# EAGLE design Layout_LEDs_Peter (EAGLE 5.07)
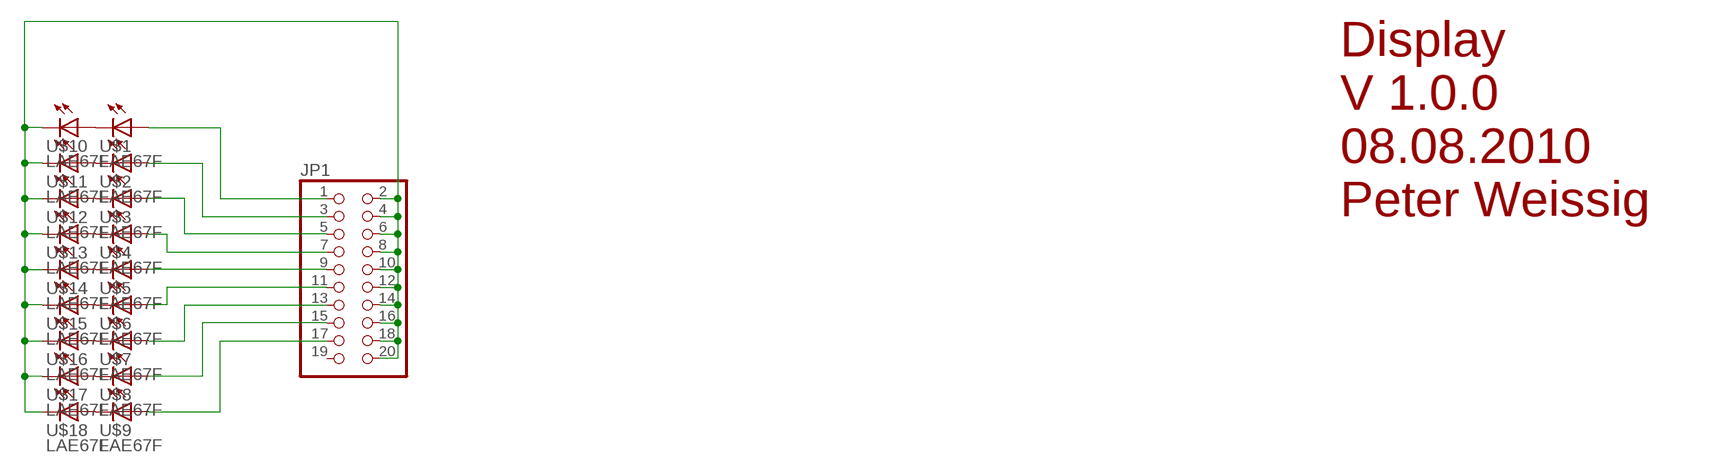
[diagram p0: schematic, sheet 1]

## Parts
JP1  PINHD-2X10  [2X10]
U$1  LAE67F  [P-LCC-4-SCHMALL]
U$2  LAE67F  [P-LCC-4-SCHMALL]
U$3  LAE67F  [P-LCC-4-SCHMALL]
U$4  LAE67F  [P-LCC-4-SCHMALL]
U$5  LAE67F  [P-LCC-4-SCHMALL]
U$6  LAE67F  [P-LCC-4-SCHMALL]
U$7  LAE67F  [P-LCC-4-SCHMALL]
U$8  LAE67F  [P-LCC-4-SCHMALL]
U$9  LAE67F  [P-LCC-4-SCHMALL]
U$10  LAE67F  [P-LCC-4-SCHMALL]
U$11  LAE67F  [P-LCC-4-SCHMALL]
U$12  LAE67F  [P-LCC-4-SCHMALL]
U$13  LAE67F  [P-LCC-4-SCHMALL]
U$14  LAE67F  [P-LCC-4-SCHMALL]
U$15  LAE67F  [P-LCC-4-SCHMALL]
U$16  LAE67F  [P-LCC-4-SCHMALL]
U$17  LAE67F  [P-LCC-4-SCHMALL]
U$18  LAE67F  [P-LCC-4-SCHMALL]

## Nets
GND: JP1.2 JP1.4 JP1.6 JP1.8 JP1.10 JP1.12 JP1.14 JP1.16 JP1.18 JP1.20 U$10.PC$1(C) U$11.PC$1(C) U$12.PC$1(C) U$13.PC$1(C) U$14.PC$1(C) U$15.PC$1(C) U$16.PC$1(C) U$17.PC$1(C) U$18.PC$1(C)
N$1: U$1.PC$1(C) U$10.PA$1(A)
N$2: U$2.PC$1(C) U$11.PA$1(A)
N$3: U$3.PC$1(C) U$12.PA$1(A)
N$4: U$4.PC$1(C) U$13.PA$1(A)
N$5: U$5.PC$1(C) U$14.PA$1(A)
N$6: U$6.PC$1(C) U$15.PA$1(A)
N$7: U$7.PC$1(C) U$16.PA$1(A)
N$8: U$8.PC$1(C) U$17.PA$1(A)
N$9: U$9.PC$1(C) U$18.PA$1(A)
N$10: JP1.9 U$5.PA$1(A)
N$11: JP1.7 U$4.PA$1(A)
N$12: JP1.5 U$3.PA$1(A)
N$13: JP1.3 U$2.PA$1(A)
N$14: JP1.1 U$1.PA$1(A)
N$15: JP1.11 U$6.PA$1(A)
N$16: JP1.13 U$7.PA$1(A)
N$17: JP1.15 U$8.PA$1(A)
N$18: JP1.17 U$9.PA$1(A)
Unconnected: JP1.19

## Notes on the sheet
- Display
- V 1.0.0
- 08.08.2010
- Peter Weissig

## Library data of the parts
JP1 = pinhead:PINHD-2X10: PIN HEADER
U$1-U$18 = led:LAE67F

## Board
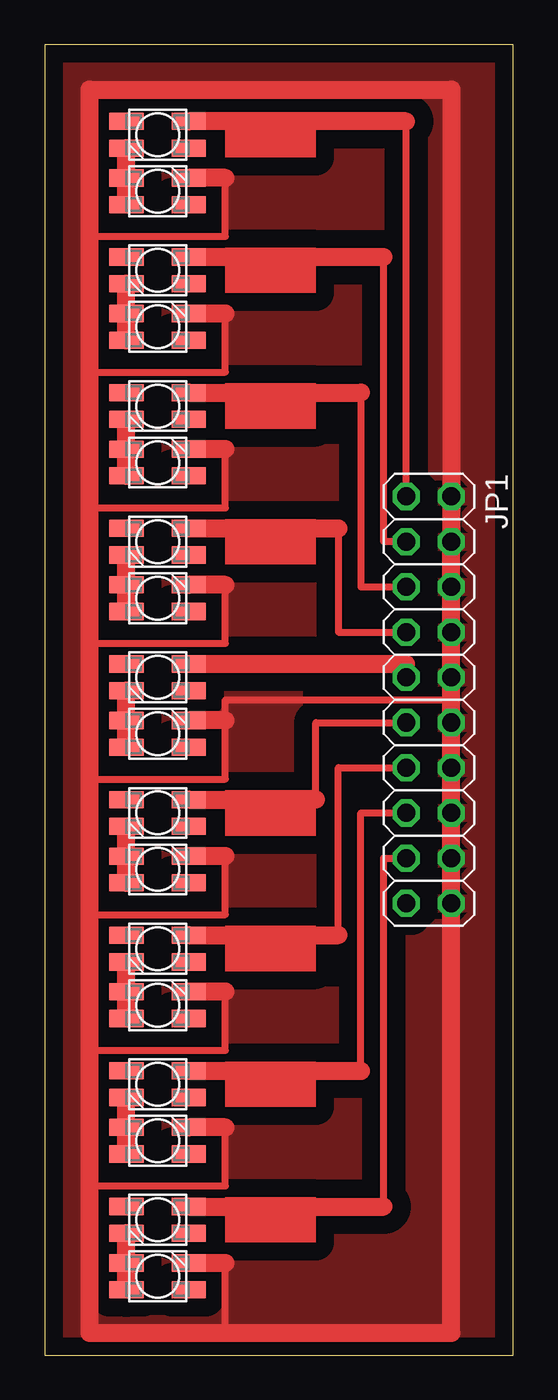
[diagram p1: board, top side]

Size 26.34 x 73.65 mm. Coordinates in mm from the lower left corner, seen from the top.
Outline: 0,0 26.34,0 26.34,73.65 0,73.65 0,0
Copper layers (1*16): Top 0.035mm / dielectric 1.5mm / Bottom 0.035mm
Design rules "default": minimum track width 10mil, minimum drill 24mil, track to track 8mil, track to pad 8mil, pad to pad 8mil, via to via 8mil, smd to smd 8mil, copper to edge 40mil, drill to drill 8mil, minimum pad ring 10mil, minimum via ring 8mil, stop-mask expansion 4mil, vias tented up to drill 0mil, thermal gap 10mil

### Footprints (pad centres in the part's own frame; a part is rotated, then mirrored left to right if it is on the bottom)
2X10 = drill 1.016 octagon: 1 -11.43,-1.27; 2 -11.43,1.27; 3 -8.89,-1.27; 4 -8.89,1.27; 5 -6.35,-1.27; 6 -6.35,1.27; 7 -3.81,-1.27; 8 -3.81,1.27; 9 -1.27,-1.27; 10 -1.27,1.27; 11 1.27,-1.27; 12 1.27,1.27; 13 3.81,-1.27; 14 3.81,1.27; 15 6.35,-1.27; 16 6.35,1.27; 17 8.89,-1.27; 18 8.89,1.27; 19 11.43,-1.27; 20 11.43,1.27
P-LCC-4-SCHMALL = smd 0.965 x 1.93: PA$1 -0.75,1.75; PA$2 0.75,1.75; PA$3 -0.75,-1.75; PC$1 0.75,-1.75

### Placement (x,y rotation side)
JP1  21.59,36.83 270 top
U$1  6.35,68.58 270 top
U$2  6.35,60.96 270 top
U$3  6.35,53.34 270 top
U$4  6.35,45.72 270 top
U$5  6.35,38.1 270 top
U$6  6.35,30.48 270 top
U$7  6.35,22.86 270 top
U$8  6.35,15.24 270 top
U$9  6.35,7.62 270 top
U$10  6.35,65.41 90 top
U$11  6.35,57.79 90 top
U$12  6.35,50.16 90 top
U$13  6.35,42.55 90 top
U$14  6.35,34.93 90 top
U$15  6.35,27.3 90 top
U$16  6.35,19.69 90 top
U$17  6.35,12.06 90 top
U$18  6.35,4.45 90 top

### Tracks (layer width: path | path; a pad name or v marks a point on that pad's centre or on a via)
GND
  Top 0.406: 10.16,12.81 10.16,9.53 2.54,9.53 | 10.16,1.27 10.16,5.2 | 10.16,20.44 10.16,17.15 2.54,17.15 | 2.54,32.39 10.16,32.39 10.16,35.68 10.16,36.83 22.86,36.83 | 10.16,43.3 10.16,40.01 2.54,40.01 | 10.16,50.91 10.16,47.62 2.54,47.62 | 10.16,58.54 10.16,55.25 2.54,55.25 | 2.54,24.77 10.16,24.77 10.16,28.05 | 10.16,66.16 10.16,62.86 2.54,62.86
  Top 1.016: 10.16,12.81 U$17.PC$1 | 10.16,5.2 U$18.PC$1 | 10.16,20.44 U$16.PC$1 | 10.16,35.68 U$14.PC$1 | 10.16,43.3 U$13.PC$1 | 10.16,50.91 U$12.PC$1 | 10.16,58.54 U$11.PC$1 | 10.16,28.05 U$15.PC$1 | 10.16,66.16 U$10.PC$1 | 2.54,1.27 2.54,9.53 2.54,17.15 2.54,24.77 2.54,32.39 2.54,40.01 2.54,47.62 2.54,55.25 2.54,62.86 2.54,71.12 22.86,71.12 JP1.2 JP1.4 JP1.6 JP1.8 JP1.10 22.86,36.83 JP1.12 JP1.14 JP1.16 JP1.18 JP1.20 22.86,1.27 10.16,1.27 2.54,1.27
  pour Top (isolate 1.016): 0,73.66 26.67,73.66 26.67,-0.63 0,-0.63
N$1
  Top 1.016: U$10.PA$1 U$1.PC$1
N$2
  Top 1.016: U$11.PA$1 U$2.PC$1
N$3
  Top 1.016: U$12.PA$1 U$3.PC$1
N$4
  Top 1.016: U$13.PA$1 U$4.PC$1
N$5
  Top 1.016: U$14.PA$1 U$5.PC$1
N$6
  Top 1.016: U$15.PA$1 U$6.PC$1
N$7
  Top 1.016: U$16.PA$1 U$7.PC$1
N$8
  Top 1.016: U$17.PA$1 U$8.PC$1
N$9
  Top 1.016: U$18.PA$1 U$9.PC$1
N$10
  Top 0.406: 20.32,38.85 JP1.9
  Top 1.016: U$5.PA$1 20.32,38.85
N$11
  Top 0.406: 16.51,46.47 16.51,40.64 JP1.7
  Top 1.016: U$4.PA$1 16.51,46.47
N$12
  Top 0.406: 17.78,54.09 17.78,43.18 JP1.5
  Top 1.016: U$3.PA$1 17.78,54.09
N$13
  Top 0.406: 19.05,61.71 19.05,45.72 JP1.3
  Top 1.016: 19.05,61.71 U$2.PA$1
N$14
  Top 0.406: JP1.1 20.32,69.33
  Top 1.016: 20.32,69.33 U$1.PA$1
N$15
  Top 0.406: 15.24,31.23 15.24,35.56 JP1.11
  Top 1.016: U$6.PA$1 15.24,31.23
N$16
  Top 0.406: 16.51,23.61 16.51,33.02 JP1.13
  Top 1.016: U$7.PA$1 16.51,23.61
N$17
  Top 0.406: 17.78,15.99 17.78,30.48 JP1.15
  Top 1.016: U$8.PA$1 17.78,15.99
N$18
  Top 0.406: 19.05,8.37 19.05,27.94 JP1.17
  Top 1.016: U$9.PA$1 19.05,8.37
(copper drawn outside any net)
  shapes: Top area x8